# EAGLE design Rejestrator WD (EAGLE 9.2.2)
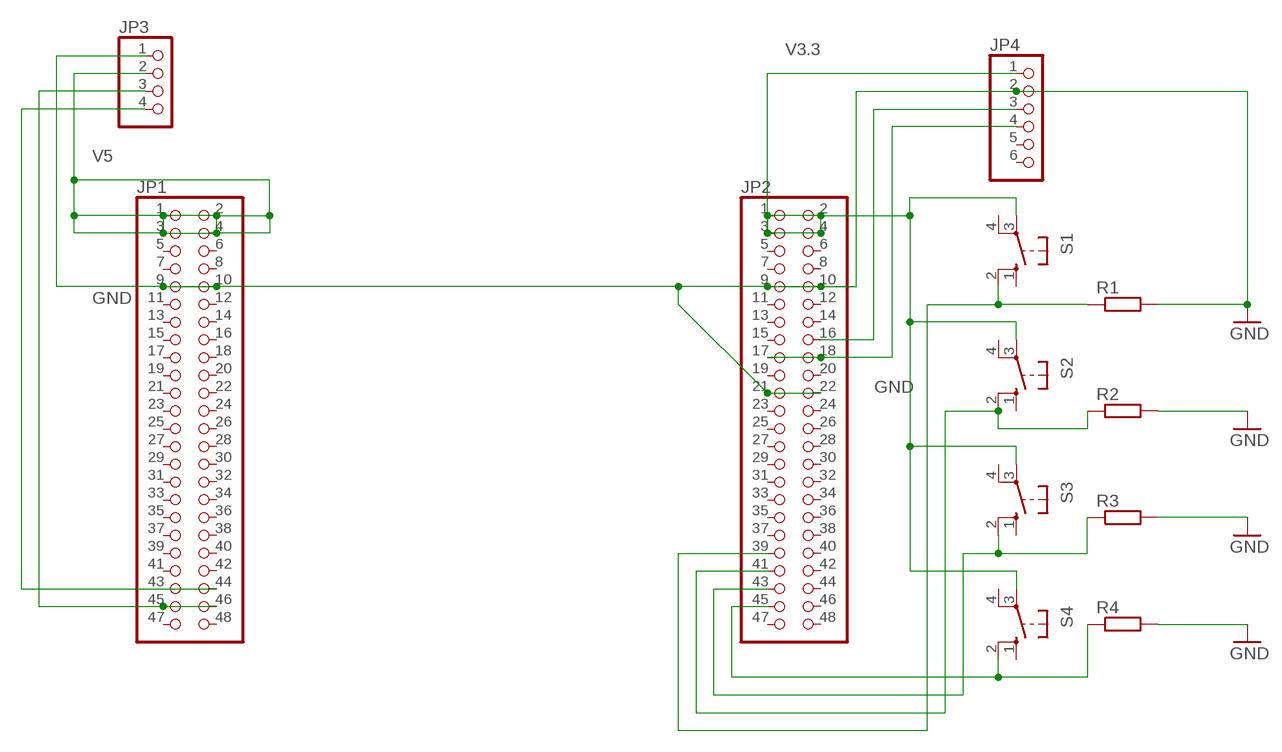
[diagram p0: schematic, sheet 1]

## Parts
JP1  PINHD-2X24  [2X24]
JP2  PINHD-2X24  [2X24]
JP3  PINHD-1X4/90  [1X04/90]
JP4  PINHD-1X6  [1X06]
R1  R-EU_0207/10  [0207/10]
R2  R-EU_0207/10  [0207/10]
R3  R-EU_0207/10  [0207/10]
R4  R-EU_0207/10  [0207/10]
S1  40-XX  [B3F-40XX]
S2  40-XX  [B3F-40XX]
S3  40-XX  [B3F-40XX]
S4  40-XX  [B3F-40XX]

## Nets
GND: JP1.9 JP1.10 JP2.9 JP2.10 JP2.21 JP2.22 JP3.1 JP4.2 R1.2 R2.2 R3.2 R4.2
N$1: JP1.45 JP1.46 JP3.3
N$2: JP2.16 JP4.3
N$3: JP1.44 JP3.4
N$4: JP2.45 R4.1 S4.2(S1)
N$5: JP2.43 R3.1 S3.2(S1)
N$6: JP2.41 R2.1 S2.2(S1)
N$7: JP2.39 R1.1 S1.2(S1)
N$12: JP2.17 JP2.18 JP4.4
V3.3: JP2.1 JP2.2 JP2.3 JP2.4 JP4.1 S1.3(P) S2.3(P) S3.3(P) S4.3(P)
V5: JP1.1 JP1.2 JP1.3 JP1.4 JP3.2
Unconnected: JP1.5 JP1.6 JP1.7 JP1.8 JP1.11 JP1.12 JP1.13 JP1.14 JP1.15 JP1.16 JP1.17 JP1.18 JP1.19 JP1.20 JP1.21 JP1.22 JP1.23 JP1.24 JP1.25 JP1.26 JP1.27 JP1.28 JP1.29 JP1.30 JP1.31 JP1.32 JP1.33 JP1.34 JP1.35 JP1.36 JP1.37 JP1.38 JP1.39 JP1.40 JP1.41 JP1.42 JP1.43 JP1.47 JP1.48 JP2.5 JP2.6 JP2.7 JP2.8 JP2.11 JP2.12 JP2.13 JP2.14 JP2.15 JP2.19 JP2.20 JP2.23 JP2.24 JP2.25 JP2.26 JP2.27 JP2.28 JP2.29 JP2.30 JP2.31 JP2.32 JP2.33 JP2.34 JP2.35 JP2.36 JP2.37 JP2.38 JP2.40 JP2.42 JP2.44 JP2.46 JP2.47 JP2.48 JP4.5 JP4.6 S1.1(S) S1.4(P1) S2.1(S) S2.4(P1) S3.1(S) S3.4(P1) S4.1(S) S4.4(P1)

## Library data of the parts
JP1 JP2 = pinhead:PINHD-2X24: PIN HEADER
JP3 = pinhead:PINHD-1X4: PIN HEADER
JP4 = pinhead:PINHD-1X6: PIN HEADER
R1-R4 = resistor:R-EU_: RESISTOR, European symbol
S1-S4 = switch-omron:40-XX: OMRON SWITCH; MF: OMRON COMPONENTS USA; MPN: B3F-4000; OC_FARNELL: 176434; OC_NEWARK: 36K3105

## Net classes
0 GND: width 0.762 mm, drill 0.254 mm, clearance 0.254 mm

## Board
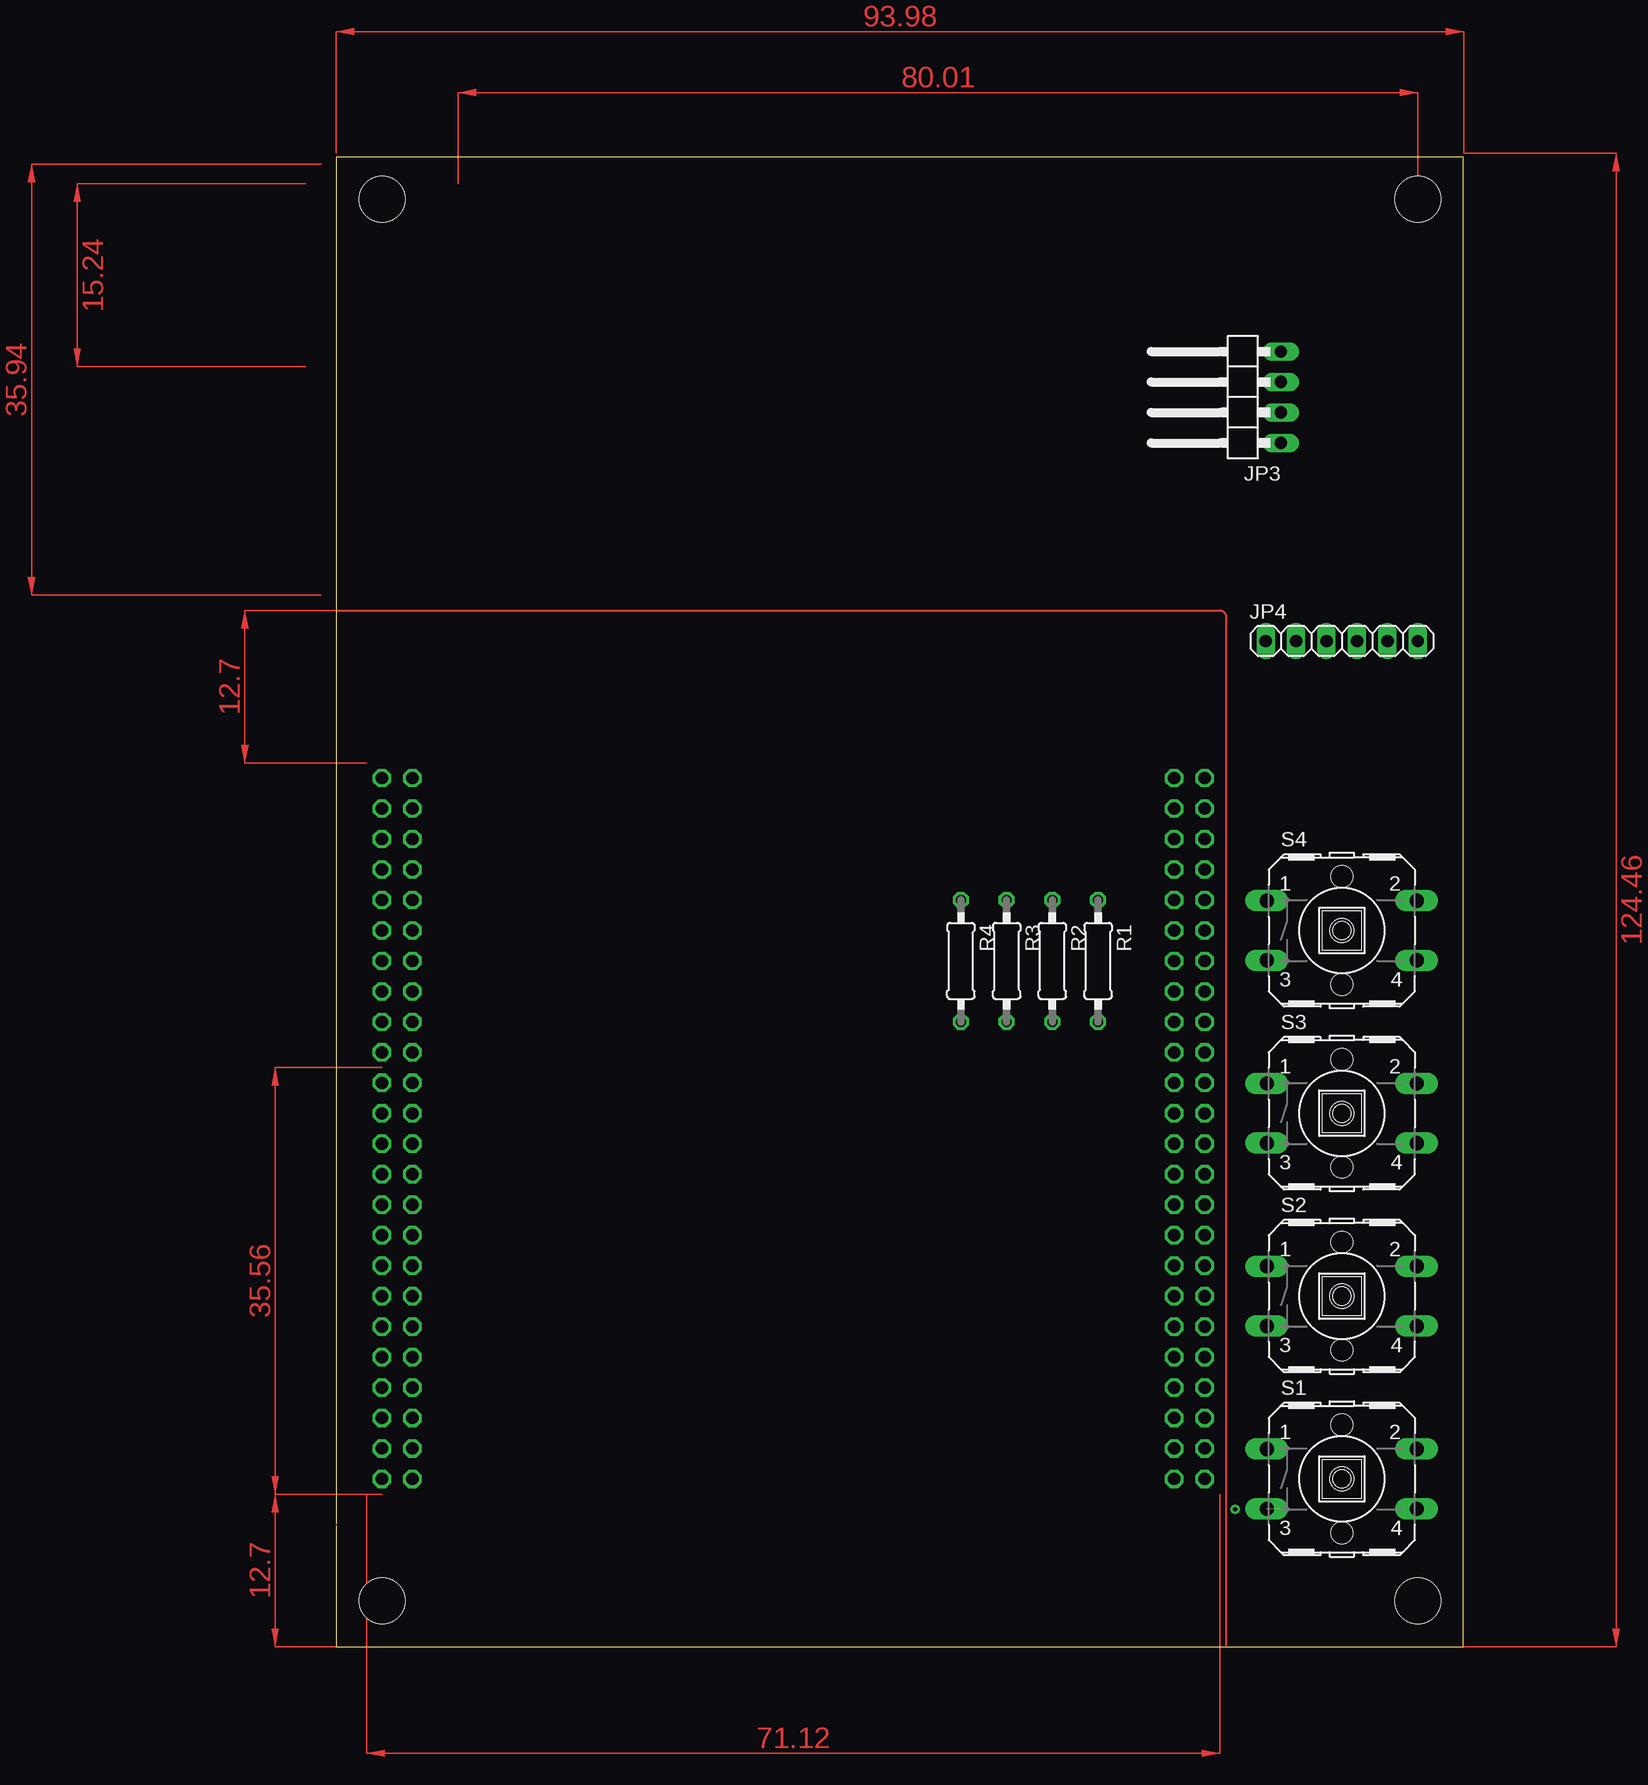
[diagram p1: board, top side]
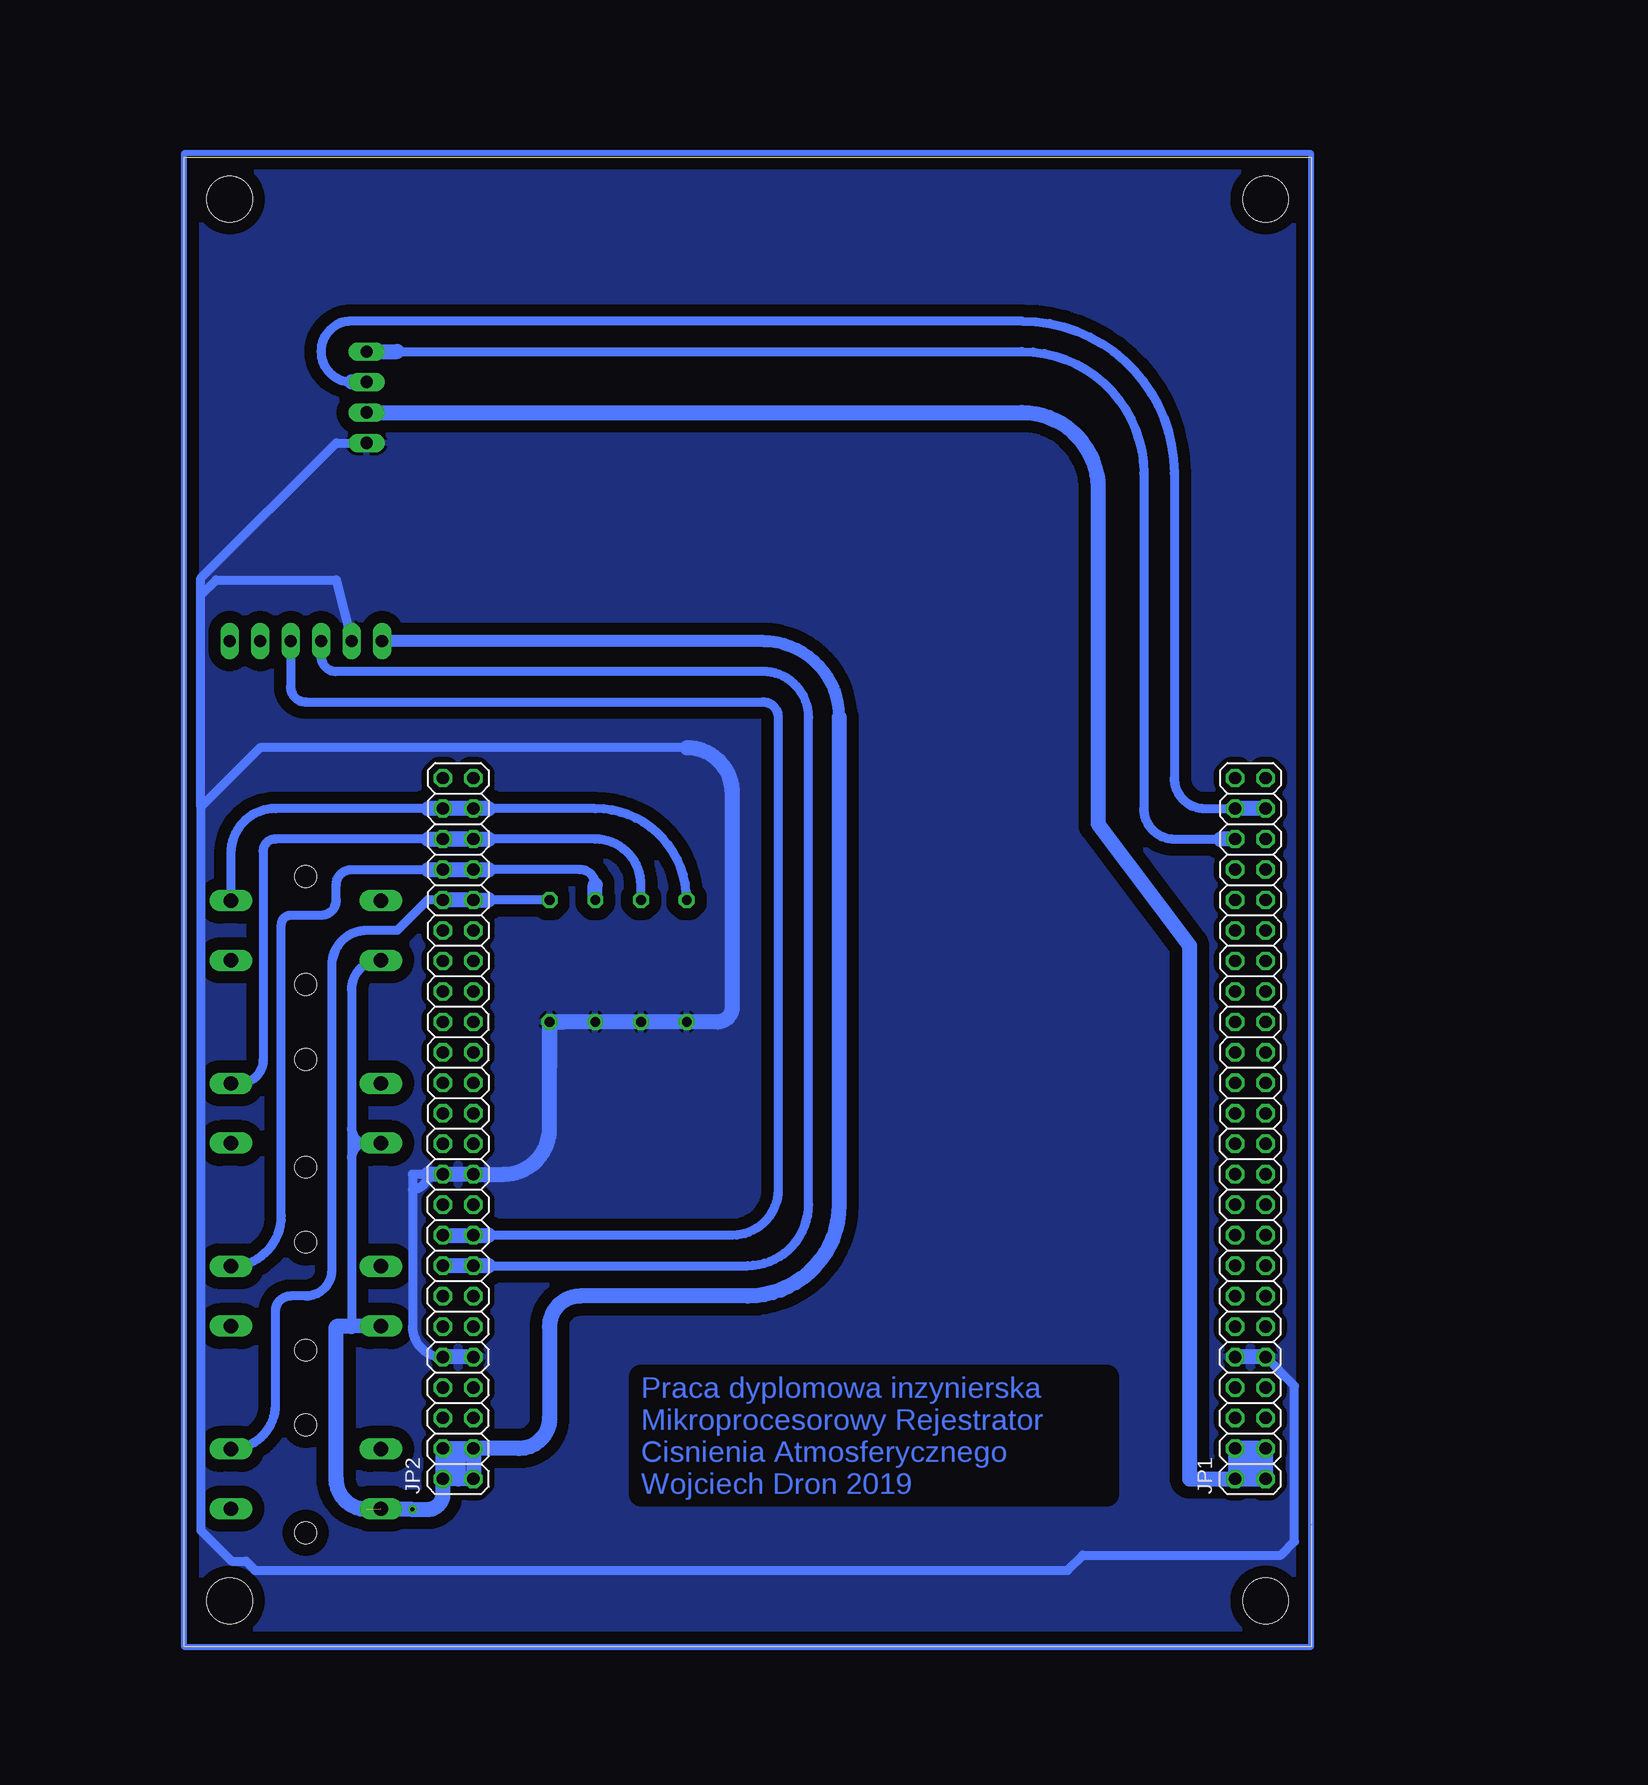
[diagram p2: board, bottom side, seen from below]

Size 93.96 x 124.13 mm. Coordinates in mm from the lower left corner, seen from the top.
Outline: 0,10.24 0,124.13 93.96,124.13 93.96,0 0,0 0,10.08
Copper layers (1*16): Top 0.035mm / dielectric 1.5mm / Bottom 0.035mm
Design rules "default": minimum track width 6mil, minimum drill 0.35mm, track to track 6mil, track to pad 6mil, pad to pad 6mil, via to via 6mil, smd to smd 6mil, copper to edge 40mil, drill to drill 6mil, minimum pad ring 10mil, minimum via ring 8mil, stop-mask expansion 4mil, vias tented up to drill 0mil, thermal gap 10mil
Holes 3.81 mm at 90.17,3.81 3.81,3.81 90.17,120.65 3.81,120.65

### Footprints (pad centres in the part's own frame; a part is rotated, then mirrored left to right if it is on the bottom)
2X24 = drill 1.016 octagon: 1 -27.94,-1.27; 2 -27.94,1.27; 3 -25.4,-1.27; 4 -25.4,1.27; 5 -22.86,-1.27; 6 -22.86,1.27; 7 -20.32,-1.27; 8 -20.32,1.27; 9 -17.78,-1.27; 10 -17.78,1.27; 11 -15.24,-1.27; 12 -15.24,1.27; 13 -12.7,-1.27; 14 -12.7,1.27; 15 -10.16,-1.27; 16 -10.16,1.27; 17 -7.62,-1.27; 18 -7.62,1.27; 19 -5.08,-1.27; 20 -5.08,1.27; 21 -2.54,-1.27; 22 -2.54,1.27; 23 0,-1.27; 24 0,1.27; 25 2.54,-1.27; 26 2.54,1.27; 27 5.08,-1.27; 28 5.08,1.27; 29 7.62,-1.27; 30 7.62,1.27; 31 10.16,-1.27; 32 10.16,1.27; 33 12.7,-1.27; 34 12.7,1.27; 35 15.24,-1.27; 36 15.24,1.27; 37 17.78,-1.27; 38 17.78,1.27; 39 20.32,-1.27; 40 20.32,1.27; 41 22.86,-1.27; 42 22.86,1.27; 43 25.4,-1.27; 44 25.4,1.27; 45 27.94,-1.27; 46 27.94,1.27; 47 30.48,-1.27; 48 30.48,1.27
1X04/90 = drill 1.016 long: 1 -3.81,-3.81; 2 -1.27,-3.81; 3 1.27,-3.81; 4 3.81,-3.81
1X06 = drill 1.016 long: 1 -6.35,0; 2 -3.81,0; 3 -1.27,0; 4 1.27,0; 5 3.81,0; 6 6.35,0
0207/10 = drill 0.813 octagon: 1 -5.08,0; 2 5.08,0
B3F-40XX = drill 1.194 long: 1 -6.248,2.489; 2 6.248,2.489; 3 -6.248,-2.489; 4 6.248,-2.489 | hole 1.803: 0,-4.496; 0,4.496

### Placement (x,y rotation side)
JP1  5.08,41.91 90 bottom
JP2  71.12,41.91 90 bottom
JP3  74.93,104.14 90 top
JP4  83.82,83.82 0 top
R1  63.5,57.15 270 top
R2  59.69,57.15 270 top
R3  55.88,57.15 270 top
R4  52.07,57.15 270 top
S1  83.82,13.97 0 top
S2  83.82,29.21 0 top
S3  83.82,44.45 0 top
S4  83.82,59.69 0 top

### Tracks (layer width: path | path; a pad name or v marks a point on that pad's centre or on a via)
GND
  Bottom 0.762: 73.66,39.37 74.93,39.37 74.93,38.1 | 74.93,38.1 74.93,26.67 arc-90 JP2.10 | 73.66,39.37 arc90 74.93,38.1 | 73.66,39.37 arc90 74.93,38.1 | 52.07,74.93 87.63,74.93 92.56,70 | 92.56,70 92.56,9.67 90,7.11 88.8,7.11 88.04,6.35 20.32,6.35 19.05,7.62 2.54,7.62 1.4,8.76 1.4,21.72 JP1.9 | 92.56,70 92.56,87.63 | 92.56,87.63 92.56,89.05 81.28,100.33 JP3.1 | 92.56,87.63 91.29,88.9 81.28,88.9 JP4.2
  Bottom 1.27: R1.2 R2.2 R3.2 R4.2 49.53,52.07 arc-90 48.26,53.34 48.26,71.12 arc-90 52.07,74.93 | JP1.9 JP1.10 | JP2.9 JP2.10 | R1.2 63.5,48.26 | 73.66,39.37 JP2.22 JP2.21 67.31,39.37 arc-90 63.5,43.18 R1.2 | R1.2 62.23,52.07
  pour Bottom (isolate 1.016): 0,124.46 93.98,124.46 93.98,0 0,0
N$1
  Bottom 0.762: 80.01,105.41 arc180 80.01,110.49 24.13,110.49 arc90 11.43,97.79 11.43,72.39 arc-90 8.89,69.85 JP1.46 7.39,69.85
  Bottom 1.27: JP1.45 JP1.46 | JP3.3 80.01,105.41
N$2
  Bottom 0.762: 68.58,31.75 46.99,31.75 arc-90 41.91,36.83 41.91,77.47 arc-90 45.72,81.28 81.28,81.28 arc90 82.55,82.55 JP4.3
  Bottom 1.27: 68.58,31.75 JP2.16
N$3
  Bottom 0.762: 76.2,107.95 24.13,107.95 arc90 13.97,97.79 13.97,69.85 arc-90 11.43,67.31 JP1.44
  Bottom 1.27: JP1.44 7.62,67.31 | JP3.4 76.2,107.95
N$4
  Bottom 0.762: R4.1 arc-90 59.69,69.85 68.58,69.85 JP2.45 | 72.39,69.85 73.66,69.85 86.36,69.85 arc-90 90.07,66.14 S4.2
  Bottom 1.27: JP2.45 72.39,69.85 | 68.58,69.85 73.66,69.85
N$5
  Bottom 0.762: R3.1 55.88,63.5 arc-90 59.69,67.31 68.58,67.31 JP2.43 | 72.39,67.31 73.66,67.31 86.36,67.31 arc-90 87.38,66.29 87.38,48.9 arc90 89.33,46.94 S3.2
  Bottom 1.27: JP2.43 72.39,67.31 | 73.66,67.31 68.58,67.31
N$6
  Bottom 0.762: 59.69,63.5 arc-90 60.96,64.77 68.58,64.77 | S2.2 arc-90 85.85,35.92 85.85,60.2 arc90 85.09,60.96 82.55,60.96 arc-90 81.28,62.23 81.28,63.5 arc90 80.01,64.77 73.66,64.77
  Bottom 1.27: R2.1 59.69,63.5 | 73.66,64.77 JP2.41 68.58,64.77
N$7
  Bottom 0.762: R1.1 68.58,62.23 | 90.07,16.51 S1.2 arc-90 86.36,20.17 86.36,27.94 arc90 85.09,29.21 83.82,29.21 arc-90 81.66,31.37 81.66,56.77 arc90 78.74,59.69 76.2,59.69 73.66,62.23 72.39,62.23
  Bottom 1.27: 72.39,62.23 JP2.39 68.58,62.23
N$8
  Top 0.152: 0,86.36 73.66,86.36 arc-90 74.17,85.85 74.17,0.13
N$9
  Bottom 0.508: 0,124.46 93.98,124.46 93.98,0 0,0 0,124.46
N$12
  Bottom 0.762: 68.58,34.29 48.26,34.29 arc-90 44.45,38.1 44.45,77.47 arc-90 45.72,78.74 83.82,78.74 arc90 85.09,80.01 JP4.4
  Bottom 1.27: JP2.18 JP2.17 68.58,34.29
V3.3  (via drill 0.35)  (1 unrouted)
  Bottom 0.762: S4.3 arc-90 80.01,54.76 80.01,43.18 | 80.01,43.18 arc-90 78.79,41.96 | 78.79,41.96 S3.3 | 78.79,41.96 arc-90 80.01,40.74 | 80.01,40.74 80.01,26.69 | 80.01,43.18 arc-90 80.01,43.18 | 80.01,43.18 80.01,40.74
  Bottom 1.016: JP4.1 45.72,83.82 arc90 39.37,77.47
  Bottom 1.27: S2.3 80.01,26.69 81.28,26.67 81.28,13.97 arc-90 78.74,11.43 v74.93,11.43 73.66,11.43 arc-90 72.39,12.7 JP2.2 | JP2.2 JP2.4 | JP2.4 JP2.3 | JP2.3 JP2.1 71.12,13.97 | 71.12,13.97 JP2.2 | 39.37,77.47 39.37,36.83 arc90 46.99,29.21 60.96,29.21 arc-90 63.5,26.67 63.5,19.05 arc90 66.04,16.51 JP2.3 | JP2.3 arc-90 71.12,15.24 | JP2.2 arc-90 71.12,15.24 | JP2.4 arc90 71.12,15.24 | 71.12,15.24 71.12,13.97
V5
  Bottom 1.27: JP1.2 10.16,13.97 10.16,58.42 17.78,68.58 17.78,96.52 arc-90 24.13,102.87 JP3.2 | JP1.2 JP1.1 3.81,15.24 | 3.81,15.24 JP1.3 | JP1.3 JP1.4 JP1.2 | JP1.3 arc-90 JP1.2 | JP1.2 arc90 5.08,15.24 3.81,15.24
(copper drawn outside any net)
  shapes: Top area x9

### Text on the board
Bottom: Praca dyplomowa inzynierska / Mikroprocesorowy Rejestrator / Cisnienia Atmosferycznego / Wojciech Dron 2019